# EAGLE design eurorack-passive-hpeq (EAGLE 9.6.2)
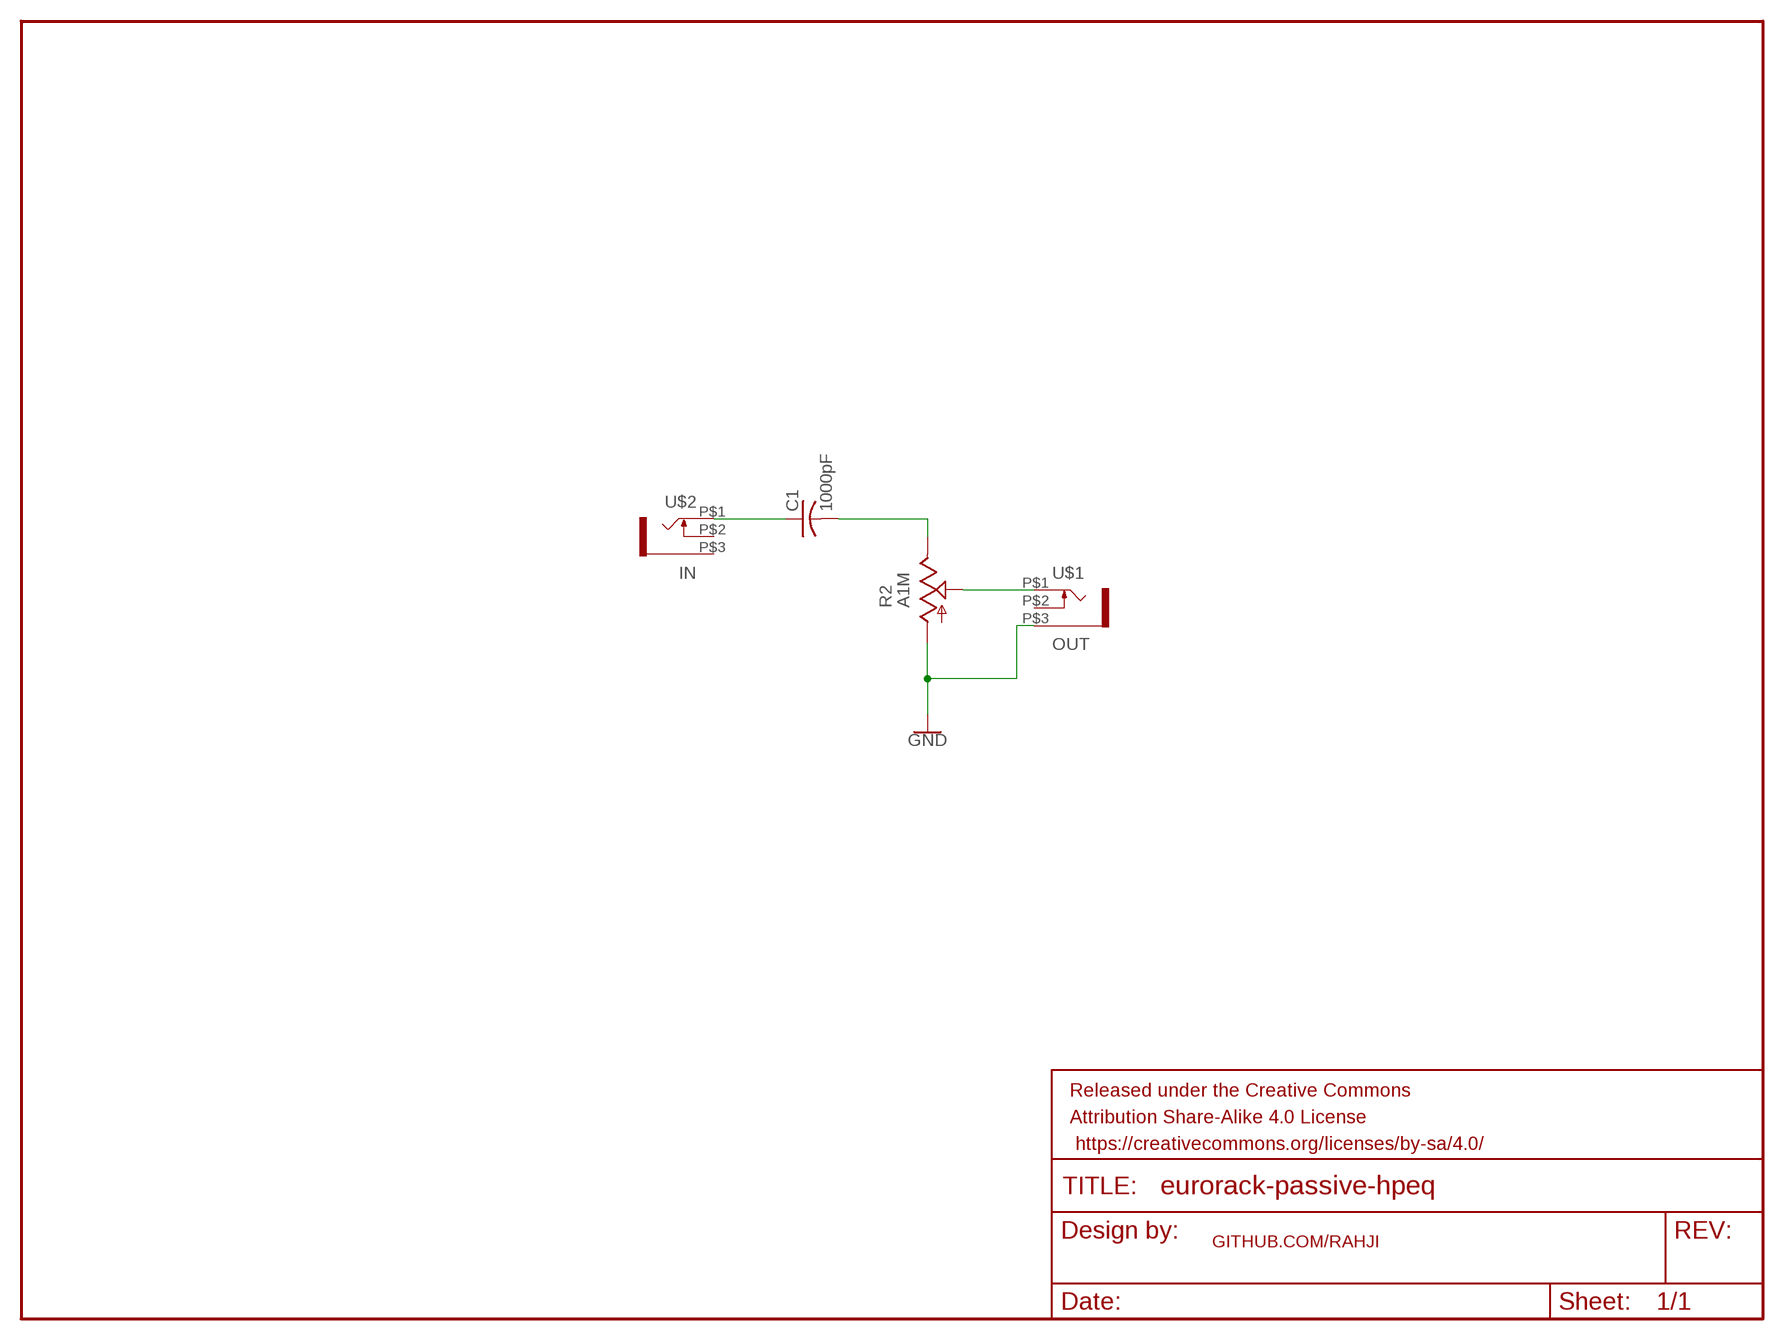
[diagram p0: schematic, sheet 1]

## Parts
C1  1000pF  C-US025-025X050  [C025-025X050]
FRAME1  FRAME-LETTERNO_PACKAGE  [DUMMY]
R2  A1M  ALPHA-9MMF3A  [EVUF]
U$1  OUT  WQP-PJ301M-12_JACK  [WQP-PJ301M-12_JACK]
U$2  IN  WQP-PJ301M-12_JACK  [WQP-PJ301M-12_JACK]

## Nets
GND: R2.1(A) U$1.P$3
N$1: C1.1 U$2.P$1
N$2: C1.2 R2.3(E)
N$3: R2.2(S) U$1.P$1
Unconnected: U$1.P$2 U$2.P$2 U$2.P$3

## Notes on the sheet
- GITHUB.COM/RAHJI

## Library data of the parts
C1 = adafruit:C-US: CAPACITOR, American symbol
FRAME1 = SparkFun-Aesthetics:FRAME-LETTER: Schematic Frame - Letter Standard 8.5x11 US Letter frame; DESIGNER: Nobody; VERSION: v01
R2 = TomW:ALPHA-9MM: 9 mm Square Rotary Potentiometers Source: Panasonic
U$1 U$2 = thonkiconn:WQP-PJ301M-12_JACK

## Board
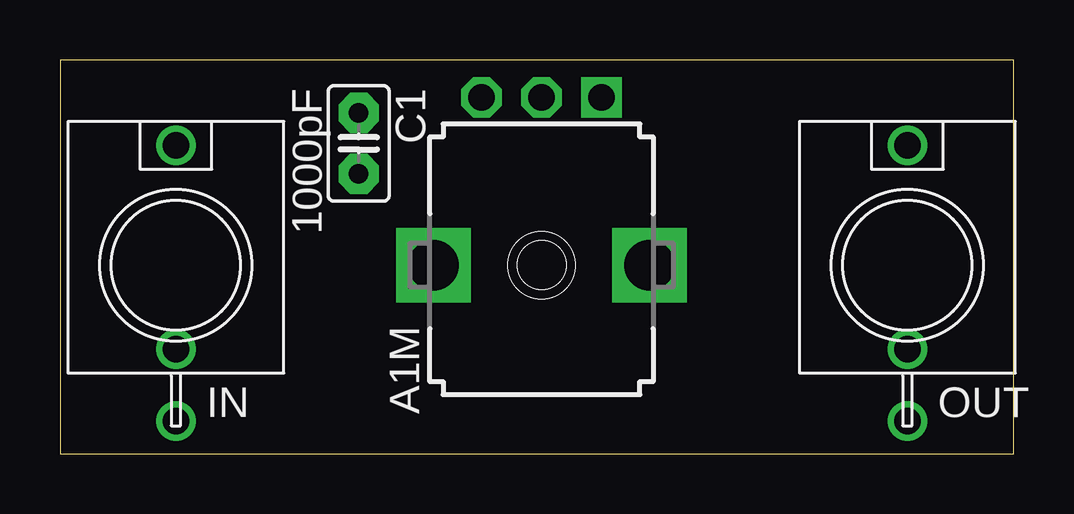
[diagram p1: board, top side]
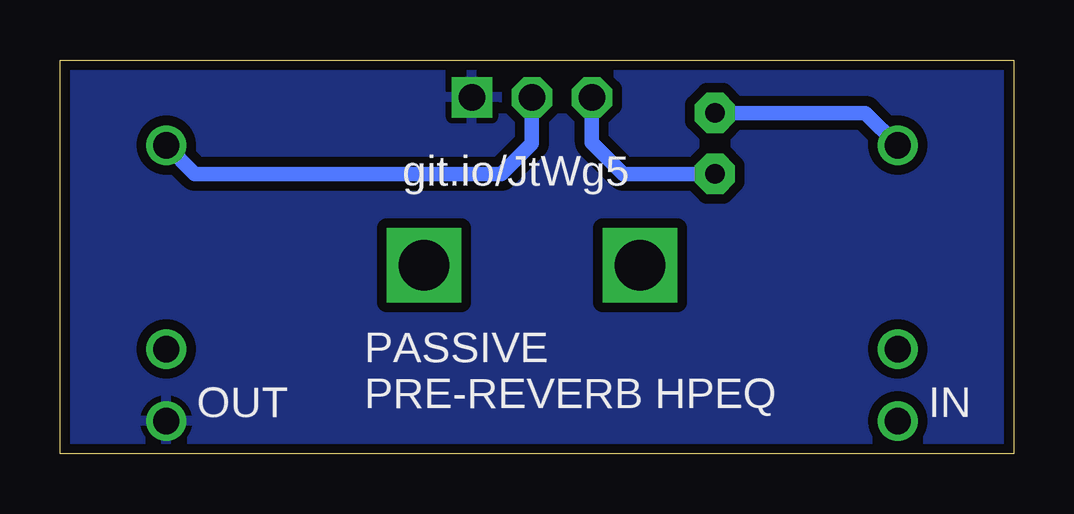
[diagram p2: board, bottom side, seen from below]

Size 39.73 x 16.43 mm. Coordinates in mm from the lower left corner, seen from the top.
Outline: 0,0 39.73,0 39.73,16.43 0,16.43 0,0
Copper layers (1*16): Top 0.0356mm / dielectric 1.5011mm / Bottom 0.0356mm
Design rules "oshpark-2layer": minimum track width 6mil, minimum drill 13mil, track to track 6mil, track to pad 6mil, pad to pad 6mil, via to via 6mil, smd to smd 6mil, copper to edge 15mil, drill to drill 6mil, minimum pad ring 7mil, minimum via ring 7mil, stop-mask expansion 2.5mil, vias tented up to drill 0mil, thermal gap 10mil

### Footprints (pad centres in the part's own frame; a part is rotated, then mirrored left to right if it is on the bottom)
C025-025X050 = drill 0.813 pad 1.676 octagon: 1 -1.27,0; 2 1.27,0
EVUF = drill 1.1 pad 1.676 square: 1 -2.5,-7 | drill 1.1 pad 1.676 octagon: 2 0,-7; 3 2.5,-7 | drill 2.1 pad 2.8 square: M1 4.5,0; M2 -4.5,0
WQP-PJ301M-12_JACK = drill 1.1: P$1 0,5; P$2 0,-3.5; P$3 0,-6.5

### Placement (x,y rotation side)
C1  12.45,12.95 270 top
FRAME1  -0.51,-0.25 0 top
R2  20.07,7.87 180 top
U$1  35.31,7.87 0 top
U$2  4.83,7.87 0 top

### Tracks (layer width: path | path; a pad name or v marks a point on that pad's centre or on a via)
GND
  pour Bottom (isolate 0.406): -1.78,17.53 41.4,17.53 41.4,-1.52 -1.78,-1.52
N$1
  Bottom 0.61: U$2.P$1 6.18,14.22 C1.1
N$2
  Bottom 0.61: C1.2 16.26,11.68 17.57,12.99 R2.3
N$3
  Bottom 0.61: R2.2 20.07,12.95 21.34,11.68 34.12,11.68 U$1.P$1

### Text on the board
tNames: IN | OUT
bNames: git.io/JtWg5 | IN | PASSIVE / PRE-REVERB HPEQ | OUT